# Altium schematic sheet 1.1.1_Interface_board_MCU.SchDoc
size A4; DocumentNumber: 3; SheetNumber: 3; SheetTotal: 14
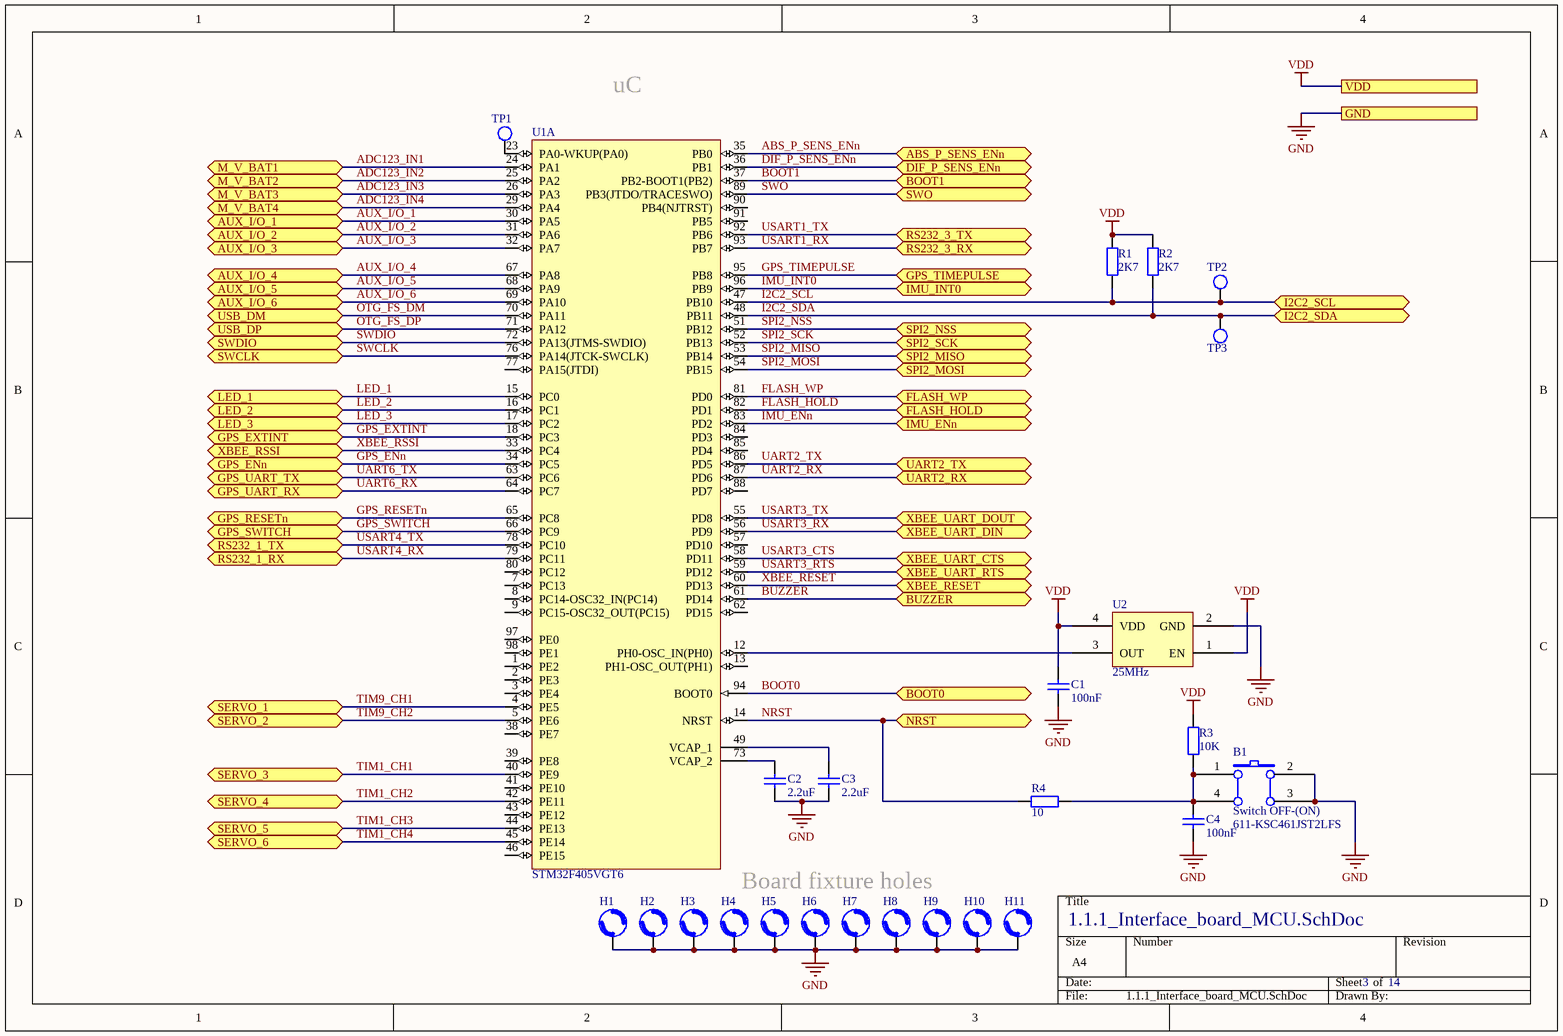
[diagram p0: 1.1.1_Interface_board_MCU.SchDoc]

## Parts
B1  Switch OFF-(ON)  Supplier Part Number 1: 611-KSC461JST2LFS  [Switch CK]
C1  100nF  [CAP0603R]
C2  2.2uF  [CAP1206W]
C3  2.2uF  [CAP1206W]
C4  100nF  [CAP0603R]
H1  Hole_3.2mm  [HOLE_3.2mm]  (value not drawn)
H2  Hole_3.2mm  [HOLE_3.2mm]  (value not drawn)
H3  Hole_3.2mm  [HOLE_3.2mm]  (value not drawn)
H4  Hole_3.2mm  [HOLE_3.2mm]  (value not drawn)
H5  Hole_3.2mm  [HOLE_3.2mm]  (value not drawn)
H6  Hole_3.2mm  [HOLE_3.2mm]  (value not drawn)
H7  Hole_3.2mm  [HOLE_3.2mm]  (value not drawn)
H8  Hole_3.2mm  [HOLE_3.2mm]  (value not drawn)
H9  Hole_3.2mm  [HOLE_3.2mm]  (value not drawn)
H10  Hole_3.2mm  [HOLE_3.2mm]  (value not drawn)
H11  Hole_3.2mm  [HOLE_3.2mm]  (value not drawn)
R1  2K7  [0603]
R2  2K7  [0603]
R3  10K  [0603]
R4  10  [0603]
TP1  Test point  [TP]  (value not drawn)
TP2  Test point  [TP]  (value not drawn)
TP3  Test point  [TP]  (value not drawn)
U1  STM32F405VGT6  [STM-LQFP100_N]  (part A of 2)
U2  25MHz  [SMD_3.2X2.5MM_4P]

## Ports
ABS_P_SENS_ENn (bidir), AUX_I/O_1 (bidir), AUX_I/O_2 (bidir), AUX_I/O_3 (bidir), AUX_I/O_4 (bidir), AUX_I/O_5 (bidir), AUX_I/O_6 (bidir), BOOT0 (bidir), BOOT1 (bidir), BUZZER (bidir), DIF_P_SENS_ENn (bidir), FLASH_HOLD (bidir), FLASH_WP (bidir), GND, GPS_ENn (bidir), GPS_EXTINT (bidir), GPS_RESETn (bidir), GPS_SWITCH (bidir), GPS_TIMEPULSE (bidir), GPS_UART_RX (bidir), GPS_UART_TX (bidir), I2C2_SCL (bidir), I2C2_SDA (bidir), IMU_ENn (bidir), IMU_INT0 (bidir), LED_1 (bidir), LED_2 (bidir), LED_3 (bidir), M_V_BAT1 (bidir), M_V_BAT2 (bidir), M_V_BAT3 (bidir), M_V_BAT4 (bidir), NRST (bidir), RS232_1_RX (bidir), RS232_1_TX (bidir), RS232_3_RX (bidir), RS232_3_TX (bidir), SERVO_1 (bidir), SERVO_2 (bidir), SERVO_3 (bidir), SERVO_4 (bidir), SERVO_5 (bidir), SERVO_6 (bidir), SPI2_MISO (bidir), SPI2_MOSI (bidir), SPI2_NSS (bidir), SPI2_SCK (bidir), SWCLK (bidir), SWDIO (bidir), SWO (bidir), UART2_RX (bidir), UART2_TX (bidir), USB_DM (bidir), USB_DP (bidir), VDD, XBEE_RESET (bidir), XBEE_RSSI (bidir), XBEE_UART_CTS (bidir), XBEE_UART_DIN (bidir), XBEE_UART_DOUT (bidir), XBEE_UART_RTS (bidir)

## Nets
GND: B1.2(B0) B1.3(B1) C1.1 C2.1 C3.1 C4.2 H1.0 H2.0 H3.0 H4.0 H5.0 H6.0 H7.0 H8.0 H9.0 H10.0 H11.0 U2.2(GND) ; port GND
VDD: C1.2 R1.2 R2.2 R3.2 U2.1(EN) U2.4(VDD) ; port VDD
ABS_P_SENS_ENn: U1.35(PB0) ; port ABS_P_SENS_ENn
ADC123_IN1: U1.24(PA1) ; port M_V_BAT1
ADC123_IN2: U1.25(PA2) ; port M_V_BAT2
ADC123_IN3: U1.26(PA3) ; port M_V_BAT3
ADC123_IN4: U1.29(PA4) ; port M_V_BAT4
AUX_I/O_1: U1.30(PA5) ; port AUX_I/O_1
AUX_I/O_2: U1.31(PA6) ; port AUX_I/O_2
AUX_I/O_3: U1.32(PA7) ; port AUX_I/O_3
AUX_I/O_4: U1.67(PA8) ; port AUX_I/O_4
AUX_I/O_5: U1.68(PA9) ; port AUX_I/O_5
AUX_I/O_6: U1.69(PA10) ; port AUX_I/O_6
BOOT0: U1.94(BOOT0) ; port BOOT0
BOOT1: U1.37(PB2-BOOT1(PB2)) ; port BOOT1
BUZZER: U1.61(PD14) ; port BUZZER
DIF_P_SENS_ENn: U1.36(PB1) ; port DIF_P_SENS_ENn
FLASH_HOLD: U1.82(PD1) ; port FLASH_HOLD
FLASH_WP: U1.81(PD0) ; port FLASH_WP
GPS_ENn: U1.34(PC5) ; port GPS_ENn
GPS_EXTINT: U1.18(PC3) ; port GPS_EXTINT
GPS_RESETn: U1.65(PC8) ; port GPS_RESETn
GPS_SWITCH: U1.66(PC9) ; port GPS_SWITCH
GPS_TIMEPULSE: U1.95(PB8) ; port GPS_TIMEPULSE
I2C2_SCL: R1.1 TP2.1 U1.47(PB10) ; port I2C2_SCL
I2C2_SDA: R2.1 TP3.1 U1.48(PB11) ; port I2C2_SDA
IMU_ENn: U1.83(PD2) ; port IMU_ENn
IMU_INT0: U1.96(PB9) ; port IMU_INT0
LED_1: U1.15(PC0) ; port LED_1
LED_2: U1.16(PC1) ; port LED_2
LED_3: U1.17(PC2) ; port LED_3
NRST: R4.1 U1.14(NRST) ; port NRST
OTG_FS_DM: U1.70(PA11) ; port USB_DM
OTG_FS_DP: U1.71(PA12) ; port USB_DP
SPI2_MISO: U1.53(PB14) ; port SPI2_MISO
SPI2_MOSI: U1.54(PB15) ; port SPI2_MOSI
SPI2_NSS: U1.51(PB12) ; port SPI2_NSS
SPI2_SCK: U1.52(PB13) ; port SPI2_SCK
SWCLK: U1.76(PA14(JTCK-SWCLK)) ; port SWCLK
SWDIO: U1.72(PA13(JTMS-SWDIO)) ; port SWDIO
SWO: U1.89(PB3(JTDO/TRACESWO)) ; port SWO
TIM1_CH1: U1.40(PE9) ; port SERVO_3
TIM1_CH2: U1.42(PE11) ; port SERVO_4
TIM1_CH3: U1.44(PE13) ; port SERVO_5
TIM1_CH4: U1.45(PE14) ; port SERVO_6
TIM9_CH1: U1.4(PE5) ; port SERVO_1
TIM9_CH2: U1.5(PE6) ; port SERVO_2
UART2_RX: U1.87(PD6) ; port UART2_RX
UART2_TX: U1.86(PD5) ; port UART2_TX
UART6_RX: U1.64(PC7) ; port GPS_UART_RX
UART6_TX: U1.63(PC6) ; port GPS_UART_TX
USART1_RX: U1.93(PB7) ; port RS232_3_RX
USART1_TX: U1.92(PB6) ; port RS232_3_TX
USART3_CTS: U1.58(PD11) ; port XBEE_UART_CTS
USART3_RTS: U1.59(PD12) ; port XBEE_UART_RTS
USART3_RX: U1.56(PD9) ; port XBEE_UART_DIN
USART3_TX: U1.55(PD8) ; port XBEE_UART_DOUT
USART4_RX: U1.79(PC11) ; port RS232_1_RX
USART4_TX: U1.78(PC10) ; port RS232_1_TX
XBEE_RESET: U1.60(PD13) ; port XBEE_RESET
XBEE_RSSI: U1.33(PC4) ; port XBEE_RSSI
NetB1_1: B1.1(A0) B1.4(A1) C4.1 R3.1 R4.2
NetC2_2: C2.2 U1.73(VCAP_2)
NetC3_2: C3.2 U1.49(VCAP_1)
NetTP1_1: TP1.1 U1.23(PA0-WKUP(PA0))
NetU1_12: U1.12(PH0-OSC_IN(PH0)) U2.3(OUT)

Not connected (* = marked no-connect by the designer): U1 1(PE2) 2(PE3) 3(PE4) 7(PC13) 8(PC14-OSC32_IN(PC14)) 9(PC15-OSC32_OUT(PC15)) 13(PH1-OSC_OUT(PH1)) 38(PE7) 39(PE8) 41(PE10) 43(PE12) 46(PE15) 57(PD10) 62(PD15) 77(PA15(JTDI)) 80(PC12) 84(PD3) 85(PD4) 88(PD7) 90(PB4(NJTRST)) 91(PB5) 97(PE0) 98(PE1)

## Notes on the sheet
- uC
- Board fixture holes

## Library data of the parts
B1 = Switch OFF-(ON): OFF-(ON); Supplier 1: Mouser
C1 C4 = C_100nF: Capacitor; Supplier 1: Mouser; Supplier Part Number 1: 81-GCG188R91H104KA1D
C2 C3 = C_2.2uF_1206: Capacitor; Supplier 1: Mouser; Supplier Part Number 1: 81-GCG31MR71E225JA2L
R1 R2 = R_0603_01W_2K7: 0.1W 2K7; Supplier 1: Mouser; Supplier Part Number 1: 667-ERJ-3EKF2701V
R3 = R_0603_01W_10K: 0.1W 10K; Supplier 1: Mouser; Supplier Part Number 1: 667-ERJ-3GEYJ103V
R4 = R_0603_025W_10Ohm: 0.25W 10Ohm; Supplier 1: Mouser; Supplier Part Number 1: 667-ERJ-PA3J100V
U1 = STM32F405VGT6: ARM Cortex-M4 32-bit MCU+FPU, 210 DMIPS, 1024 kB Flash, 192 kB Internal RAM, 82 I/Os, 100-pin LQFP, -40 to 85 degC, Tray; Manufacturer: STMicroelectronics; D/A Converter: 2x12-bit; FLASH Size (Prog) (kB): 1024; I/Os (High Current): 82; Internal RAM Size (kB): 192; Operating Frequency(F) (Processor speed) (MHz): 168; Supply Voltage(Vcc) max (V): 3.6; Supply Voltage(Vcc) min (V): 1.8; DatasheetVersion: Rev. 4; PackageVersion: Rev. 1, 06/2013; PackageReference: LQFP100; PackageDescription: 100-Pin Low Profile Quad Flat Package, 14 x 14 mm Body, 0.5 mm Pitch; Supplier 1: Digi-Key; Supplier Part Number 1: 497-11910-ND; Supplier 2: Farnell; Supplier Part Number 2: 2215224; Supplier 3: Newark; Supplier Part Number 3: 46W2199; Supplier 4: Newark; Supplier Part Number 4: 94T6493; Supplier 5: Mouser; Supplier Part Number 5: 511-STM32F405VGT6; Core: ARM Cortex-M4; Packing: Tray; Mounting Technology: Surface Mount; PartNumber: STM32F405VGT6; ComponentLink1Description: Manufacturer URL; ComponentLink1URL: http://www.st.com/web/en/home.html; ComponentLink2Description: Datasheet; ComponentLink2URL: http://www.st.com/st-web-ui/static/active/en/resource/technical/document/datasheet/DM00037051.pdf; ComponentLink3Description: Package Specification; ComponentLink3URL: http://www.st.com/st-web-ui/static/active/en/resource/technical/document/data_brief/DM00071938.pdf
U2 = DSC1001CI2-025.0000: Osc; Supplier 1: Mouser; Supplier Part Number 1: 998-1001CI2025.0000T